# Altium project S7.PrjPCB (part 3 of 3)
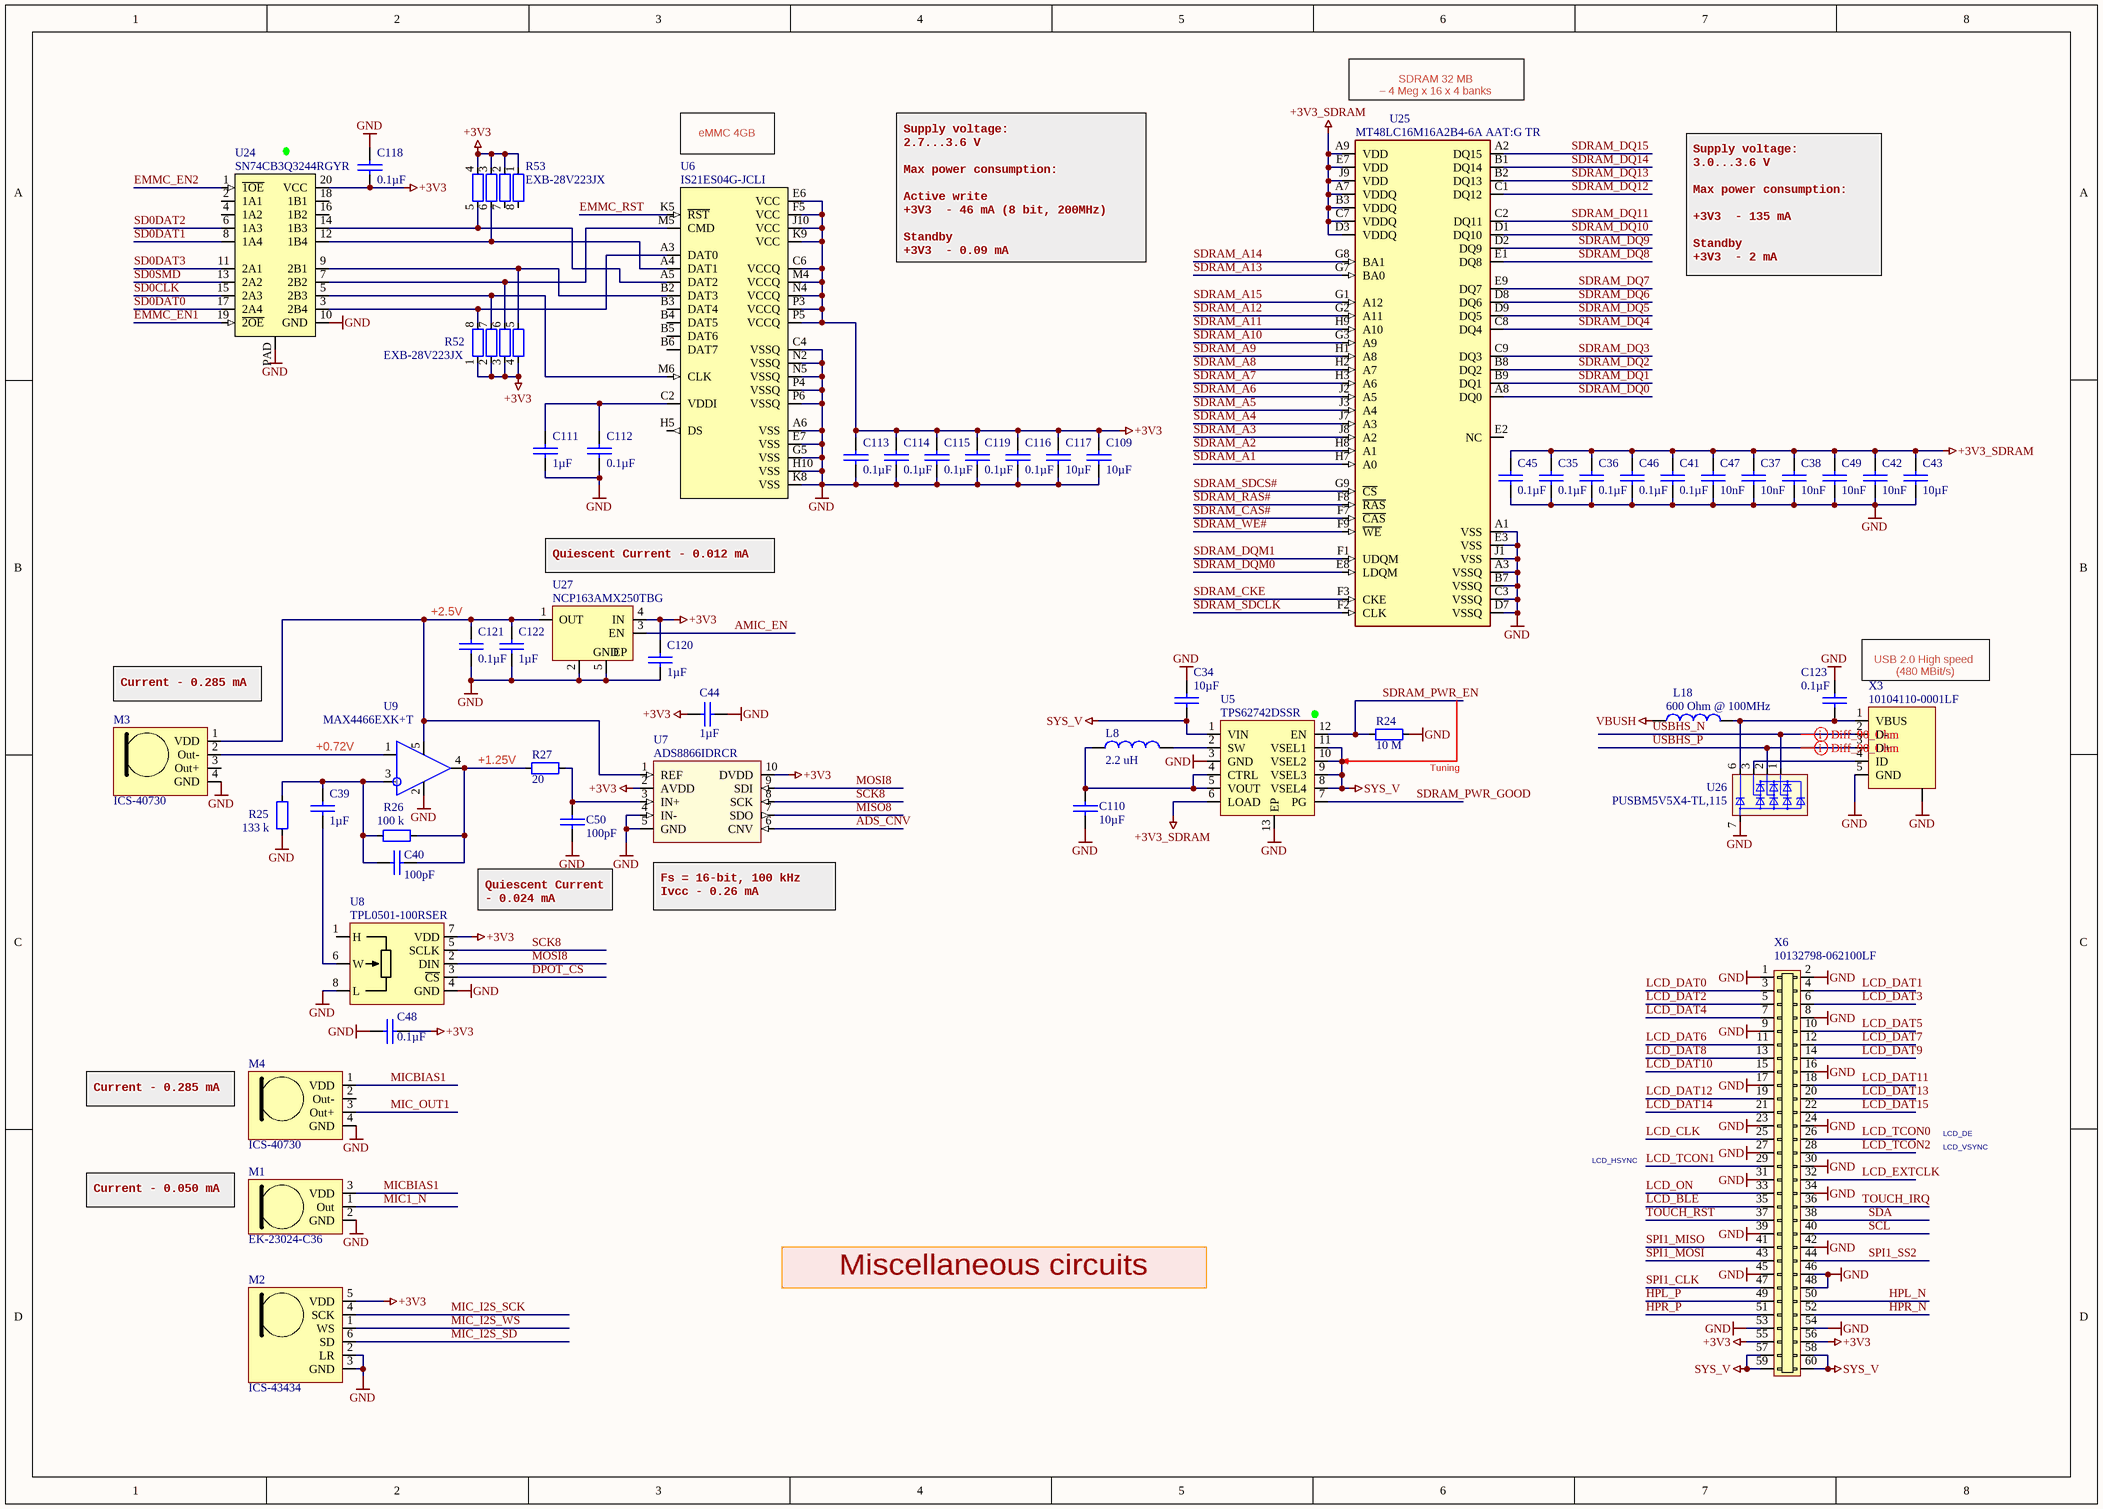
[diagram p5: S7_Misc.SchDoc]

## Nets that join several sheets
+3V3: S7_Power (46 pins), S7_RF (9 pins), S7_Audio_IMU_uSD (29 pins), S7_Misc (36 pins)
GND: S7_Power (96 pins), S7_RF (61 pins), S7_Audio_IMU_uSD (38 pins), S7_Misc (87 pins)
SYS_V: S7_Power (14 pins), S7_RF (U1.55 U1.56), S7_Misc (10 pins)
VBUS: S7_CPU (U17.A15), S7_Power (L16.2 VD1.2)
VBUSH: S7_CPU (U17.K13), S7_Power (VD3.2), S7_Misc (L18.2)
32KHZ_OSC_EN: S7_CPU (U17.G3), S7_RF (Z2.1)
ADS_CNV: S7_CPU (U17.J11), S7_Misc (U7.6)
AMIC_EN: S7_CPU (U17.G11), S7_Misc (U27.3)
AUDIO_CLK: S7_CPU (U17.N13), S7_Audio_IMU_uSD (U13.D10)
BT1: S7_CPU (U17.G6), S7_Power (BT2.1 R12.1)
BT2: S7_CPU (U17.G2), S7_Power (BT1.1 R11.1)
BT_HOST_WAKE: S7_CPU (U17.F11), S7_RF (U1.12)
BT_REG_ON: S7_CPU (U17.L13), S7_RF (U1.50)
BT_UART_CTS: S7_CPU (U17.F10), S7_RF (U1.24)
BT_UART_RTS: S7_CPU (U17.E12), S7_RF (U1.25)
BT_UART_RXD: S7_CPU (U17.E13), S7_RF (U1.27)
BT_UART_TXD: S7_CPU (U17.D15), S7_RF (U1.26)
CHARGER_INT: S7_CPU (U17.J5), S7_Power (R34.2 U11.7)
CODEC_IRQ: S7_CPU (U17.P10), S7_Audio_IMU_uSD (R35.1 U13.C13)
CODEC_PWR: S7_CPU (U17.E6), S7_Audio_IMU_uSD (U12.3)
DCDC_RUN: S7_CPU (U17.J2), S7_Power (U23.1)
DPOT_CS: S7_CPU (U17.H11), S7_Misc (U8.3)
EMMC_EN1: S7_CPU (U17.P3), S7_Misc (U24.19)
EMMC_EN2: S7_CPU (U17.L5), S7_Misc (U24.1)
EMMC_RST: S7_CPU (U17.L6), S7_Misc (U6.K5)
HPL_N: S7_Audio_IMU_uSD (U13.B6), S7_Misc (X6.50)
HPL_P: S7_Audio_IMU_uSD (U13.A5), S7_Misc (X6.49)
HPR_N: S7_Audio_IMU_uSD (U13.A3), S7_Misc (X6.52)
HPR_P: S7_Audio_IMU_uSD (U13.B4), S7_Misc (X6.51)
I_SENS: S7_CPU (U17.R12), S7_Power (U2.10)
I_SENS_EN: S7_CPU (U17.E5), S7_Power (U2.7)
IMU_CLK: S7_CPU (U17.J4), S7_Audio_IMU_uSD (U15.13)
IMU_CS: S7_CPU (U17.J3), S7_Audio_IMU_uSD (U15.12)
IMU_INT1: S7_CPU (U17.M10), S7_Audio_IMU_uSD (U15.9)
IMU_INT2: S7_CPU (U17.N10), S7_Audio_IMU_uSD (U15.4)
IMU_SDI: S7_CPU (U17.P15), S7_Audio_IMU_uSD (U15.14)
IMU_SDO: S7_CPU (U17.N14), S7_Audio_IMU_uSD (U15.1)
JTAG_TCLK/SWD_CLK: S7_CPU (U17.F5), S7_Power (X4.4)
JTAG_TDI: S7_CPU (U17.C2), S7_Power (X4.8)
JTAG_TDO/TRACE_SWO: S7_CPU (U17.B1), S7_Power (X4.6)
JTAG_TMS/SWD_DIO: S7_CPU (U17.B2), S7_Power (R31.1 X4.2)
LCD_BLE: S7_CPU (U17.A7), S7_Misc (X6.35)
LCD_CLK: S7_CPU (U17.E9), S7_Misc (X6.25)
LCD_DAT0: S7_CPU (U17.M4), S7_Misc (X6.3)
LCD_DAT1: S7_CPU (U17.P4), S7_Misc (X6.4)
LCD_DAT2: S7_CPU (U17.R3), S7_Misc (X6.5)
LCD_DAT3: S7_CPU (U17.K6), S7_Misc (X6.6)
LCD_DAT4: S7_CPU (U17.K5), S7_Misc (X6.7)
LCD_DAT5: S7_CPU (U17.J7), S7_Misc (X6.10)
LCD_DAT6: S7_CPU (U17.J6), S7_Misc (X6.11)
LCD_DAT7: S7_CPU (U17.H5), S7_Misc (X6.12)
LCD_DAT8: S7_CPU (U17.H4), S7_Misc (X6.13)
LCD_DAT9: S7_CPU (U17.G7), S7_Misc (X6.14)
LCD_DAT10: S7_CPU (U17.G8), S7_Misc (X6.15)
LCD_DAT11: S7_CPU (U17.A6), S7_Misc (X6.18)
LCD_DAT12: S7_CPU (U17.F6), S7_Misc (X6.19)
LCD_DAT13: S7_CPU (U17.F7), S7_Misc (X6.20)
LCD_DAT14: S7_CPU (U17.E7), S7_Misc (X6.21)
LCD_DAT15: S7_CPU (U17.B11), S7_Misc (X6.22)
LCD_EXTCLK: S7_CPU (U17.M12), S7_Misc (X6.32)
LCD_ON: S7_CPU (U17.B7), S7_Misc (X6.33)
LCD_TCON0: S7_CPU (U17.C11), S7_Misc (X6.26)
LCD_TCON1: S7_CPU (U17.F9), S7_Misc (X6.29)
LCD_TCON2: S7_CPU (U17.E10), S7_Misc (X6.28)
LED_B: S7_CPU (U17.K9), S7_Power (R15.1)
LED_G: S7_CPU (U17.P14), S7_Power (R14.1)
LED_R: S7_CPU (U17.P13), S7_Power (R13.1)
MIC1_N: S7_Audio_IMU_uSD (U13.B14), S7_Misc (M1.1)
MIC_CTRL: S7_CPU (U17.A11), S7_Audio_IMU_uSD (U14.4 U14.8)
MIC_I2S_SCK: S7_Audio_IMU_uSD (U20.10), S7_Misc (M2.4)
MIC_I2S_SD: S7_Audio_IMU_uSD (U19.10), S7_Misc (M2.6)
MIC_I2S_WS: S7_Audio_IMU_uSD (U19.2), S7_Misc (M2.1)
MIC_OUT1: S7_Audio_IMU_uSD (U14.3), S7_Misc (M4.3)
MICBIAS1: S7_Audio_IMU_uSD (C66.2 U13.B12), S7_Misc (M1.3 M4.1)
MISO8: S7_CPU (U17.J12), S7_Misc (U7.7)
MOSI8: S7_CPU (U17.H10), S7_Misc (U7.9 U8.2)
PVIN_V: S7_CPU (U17.M9), S7_Power (R20.1 R21.2)
PWR_GOOD: S7_CPU (U17.D9), S7_Power (U10.7)
PWR_SEL: S7_CPU (U17.P12), S7_Power (U11.2)
RF_ANT_SW: S7_CPU (U17.D8), S7_RF (R45.2)
RF_BUSY: S7_CPU (U17.N11), S7_RF (U16.14)
RF_CS: S7_CPU (U17.N6), S7_RF (U16.19)
RF_DIO1: S7_CPU (U17.R10), S7_RF (U16.13)
RF_MISO: S7_CPU (U17.N7), S7_RF (U16.16)
RF_MOSI: S7_CPU (U17.P6), S7_RF (U16.17)
RF_RST: S7_CPU (U17.E8), S7_RF (U16.15)
RF_SCK: S7_CPU (U17.M7), S7_RF (U16.18)
SCK8: S7_CPU (U17.K12), S7_Misc (U7.8 U8.5)
SCL: S7_CPU (U17.R14), S7_Power (R32.1 U11.5), S7_Audio_IMU_uSD (U13.C11), S7_Misc (X6.40)
SD0CLK: S7_CPU (U17.D12), S7_Audio_IMU_uSD (U18.15), S7_Misc (U24.15)
SD0DAT0: S7_CPU (U17.D14), S7_Audio_IMU_uSD (U18.17), S7_Misc (U24.17)
SD0DAT1: S7_CPU (U17.C15), S7_Audio_IMU_uSD (U18.8), S7_Misc (U24.8)
SD0DAT2: S7_CPU (U17.G9), S7_Audio_IMU_uSD (U18.6), S7_Misc (U24.6)
SD0DAT3: S7_CPU (U17.C12), S7_Audio_IMU_uSD (U18.11), S7_Misc (U24.11)
SD0SMD: S7_CPU (U17.D13), S7_Audio_IMU_uSD (U18.13), S7_Misc (U24.13)
SD1CLK: S7_CPU (U17.R4), S7_RF (U1.39)
SD1DAT0: S7_CPU (U17.N5), S7_RF (U1.41)
SD1DAT1: S7_CPU (U17.P5), S7_RF (U1.42)
SD1DAT2: S7_CPU (U17.R5), S7_RF (U1.43)
SD1DAT3: S7_CPU (U17.M5), S7_RF (U1.44)
SD1SMD: S7_CPU (U17.N4), S7_RF (U1.40)
SD_EN1: S7_CPU (U17.K7), S7_Audio_IMU_uSD (U18.19)
SD_EN2: S7_CPU (U17.K8), S7_Audio_IMU_uSD (U18.1)
SDA: S7_CPU (U17.R15), S7_Power (R29.1 U11.6), S7_Audio_IMU_uSD (U13.D12), S7_Misc (X6.38)
SDRAM_A1: S7_CPU (U17.E3), S7_Misc (U25.H7)
SDRAM_A2: S7_CPU (U17.E4), S7_Misc (U25.H8)
SDRAM_A3: S7_CPU (U17.D3), S7_Misc (U25.J8)
SDRAM_A4: S7_CPU (U17.C3), S7_Misc (U25.J7)
SDRAM_A5: S7_CPU (U17.C1), S7_Misc (U25.J3)
SDRAM_A6: S7_CPU (U17.B3), S7_Misc (U25.J2)
SDRAM_A7: S7_CPU (U17.A2), S7_Misc (U25.H3)
SDRAM_A8: S7_CPU (U17.A3), S7_Misc (U25.H2)
SDRAM_A9: S7_CPU (U17.C4), S7_Misc (U25.H1)
SDRAM_A10: S7_CPU (U17.D4), S7_Misc (U25.G3)
SDRAM_A11: S7_CPU (U17.D5), S7_Misc (U25.H9)
SDRAM_A12: S7_CPU (U17.D6), S7_Misc (U25.G2)
SDRAM_A13: S7_CPU (U17.D7), S7_Misc (U25.G7)
SDRAM_A14: S7_CPU (U17.C5), S7_Misc (U25.G8)
SDRAM_A15: S7_CPU (U17.C6), S7_Misc (U25.G1)
SDRAM_CAS#: S7_CPU (U17.B6), S7_Misc (U25.F7)
SDRAM_CKE: S7_CPU (U17.G4), S7_Misc (U25.F3)
SDRAM_DQ0: S7_CPU (U17.R1), S7_Misc (U25.A8)
SDRAM_DQ1: S7_CPU (U17.P1), S7_Misc (U25.B9)
SDRAM_DQ2: S7_CPU (U17.N1), S7_Misc (U25.B8)
SDRAM_DQ3: S7_CPU (U17.N2), S7_Misc (U25.C9)
SDRAM_DQ4: S7_CPU (U17.N3), S7_Misc (U25.C8)
SDRAM_DQ5: S7_CPU (U17.M3), S7_Misc (U25.D9)
SDRAM_DQ6: S7_CPU (U17.L4), S7_Misc (U25.D8)
SDRAM_DQ7: S7_CPU (U17.K4), S7_Misc (U25.E9)
SDRAM_DQ8: S7_CPU (U17.F2), S7_Misc (U25.E1)
SDRAM_DQ9: S7_CPU (U17.F3), S7_Misc (U25.D2)
SDRAM_DQ10: S7_CPU (U17.F1), S7_Misc (U25.D1)
SDRAM_DQ11: S7_CPU (U17.K1), S7_Misc (U25.C2)
SDRAM_DQ12: S7_CPU (U17.K2), S7_Misc (U25.C1)
SDRAM_DQ13: S7_CPU (U17.K3), S7_Misc (U25.B2)
SDRAM_DQ14: S7_CPU (U17.P2), S7_Misc (U25.B1)
SDRAM_DQ15: S7_CPU (U17.R2), S7_Misc (U25.A2)
SDRAM_DQM0: S7_CPU (U17.L2), S7_Misc (U25.E8)
SDRAM_DQM1: S7_CPU (U17.F4), S7_Misc (U25.F1)
SDRAM_PWR_GOOD: S7_CPU (U17.C9), S7_Misc (U5.7)
SDRAM_RAS#: S7_CPU (U17.C7), S7_Misc (U25.F8)
SDRAM_SDCLK: S7_CPU (U17.L1), S7_Misc (U25.F2)
SDRAM_SDCS#: S7_CPU (U17.E2), S7_Misc (U25.G9)
SDRAM_WE#: S7_CPU (U17.E1), S7_Misc (U25.F9)
SEL_DMIC: S7_CPU (U17.G1), S7_Audio_IMU_uSD (U19.4 U19.8 U20.4 U20.8)
SPI1_CLK: S7_CPU (U17.D11), S7_Misc (X6.47)
SPI1_MISO: S7_CPU (U17.A12), S7_Misc (X6.41)
SPI1_MOSI: S7_CPU (U17.B12), S7_Misc (X6.43)
SPI1_SS2: S7_CPU (U17.C13), S7_Misc (X6.44)
SSIRXD0: S7_CPU (U17.J9), S7_Audio_IMU_uSD (U19.9)
SSISCK0: S7_CPU (U17.N15), S7_Audio_IMU_uSD (U20.9)
SSITXD0: S7_CPU (U17.M13), S7_Audio_IMU_uSD (U13.C7)
SSIWS0: S7_CPU (U17.K10), S7_Audio_IMU_uSD (U19.3)
SYSV_V: S7_CPU (U17.R11), S7_Power (C?.2 R2.1 R3.2)
TOUCH_IRQ: S7_CPU (U17.H6), S7_Misc (X6.36)
TOUCH_RST: S7_CPU (U17.H8), S7_Misc (X6.37)
U5V_V: S7_CPU (U17.M11), S7_Power (R22.1 R23.2)
USBHS_N: S7_Power (U17.F15), S7_Misc (U26.1 X3.2)
USBHS_P: S7_Power (U17.F14), S7_Misc (U26.2 X3.3)
VACC_AIN: S7_CPU (U17.P11), S7_Power (U21.1)
VACC_EN: S7_CPU (U17.J1), S7_Power (U21.4)
WIFI_REG_ON: S7_CPU (U17.R13), S7_RF (U1.51)
WJTAG_CLK: S7_Power (X4.17), S7_RF (U1.71)
WJTAG_RST: S7_Power (X4.11), S7_RF (U1.75)
WJTAG_TDI: S7_Power (X4.13), S7_RF (U1.73)
WJTAG_TDO: S7_Power (X4.15), S7_RF (U1.74)
WJTAG_TMS: S7_Power (X4.19), S7_RF (R37.1 U1.72)